# EAGLE design rasp_rak833 (EAGLE 8.3.2)
PROJECT_AUTHOR: Daniel Knox; PROJECT_LICENSE: CC-SA-BY 4.0; PROJECT_NAME: RAK833 HAT; PROJECT_VERSION: 1
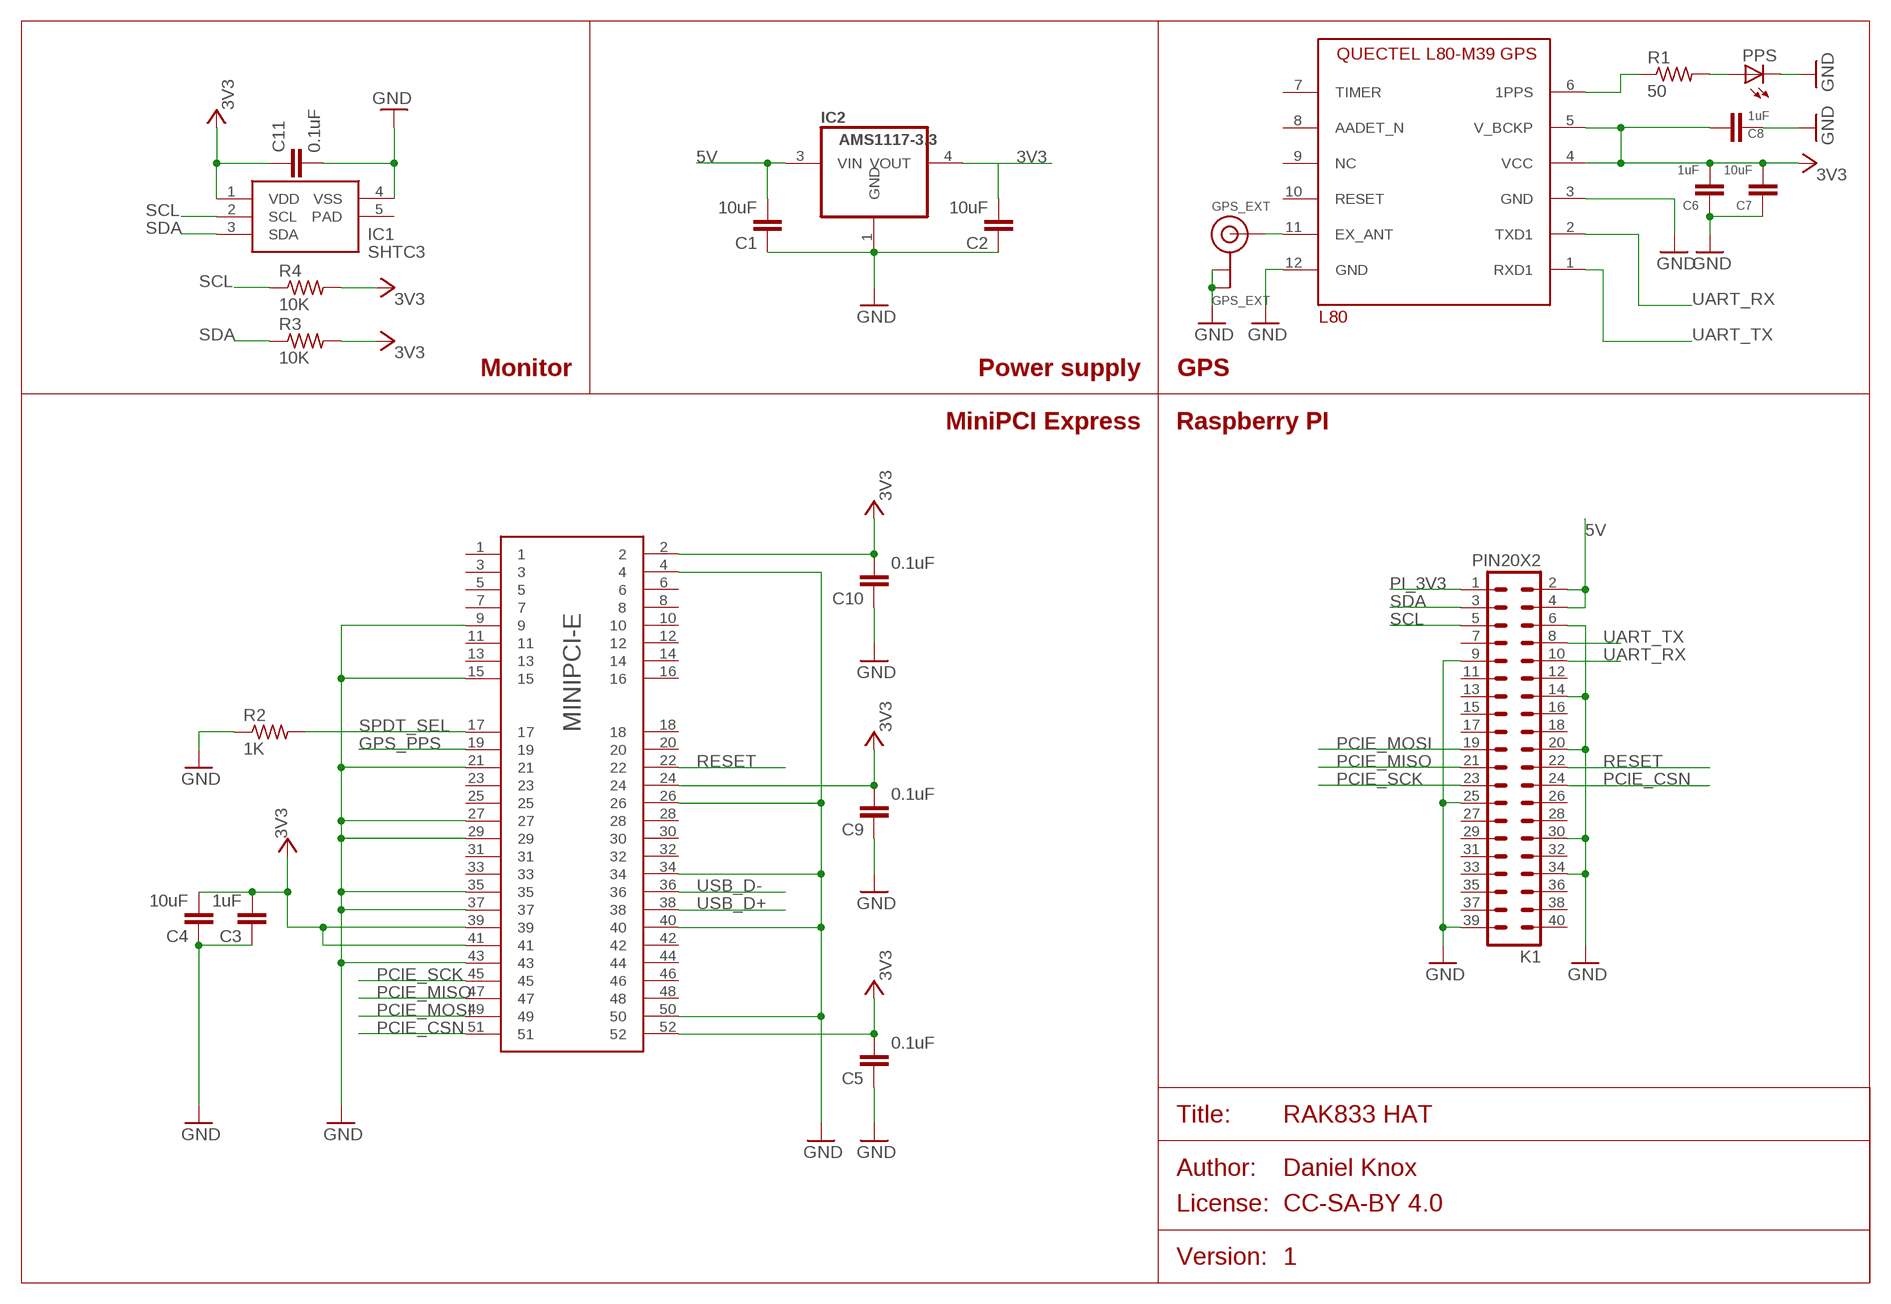
[diagram p0: schematic, sheet 1]

## Parts
C1  10uF  C-EU0805  [0805]
C2  10uF  C-EU0805  [0805]
C3  1uF  C-EU0805  [0805]
C4  10uF  C-EU0805  [0805]
C5  0.1uF  C-EU0805  [0805]
C6  1uF  C-EU0805  [0805]
C7  10uF  C-EU0805  [0805]
C8  1uF  C-EU0805  [0805]
C9  0.1uF  C-EU0805  [0805]
C10  0.1uF  C-EU0805  [0805]
C11  0.1uF  C-EU0805  [0805]
GPS_EXT  GPS_EXT  ANTENNA_U.FL  [U.FL]
IC1  SHTC3  [SHTC3]
IC2  AMS1117-3.3  REG1117SOT223-2  [SOT223]
K1  PIN20X2  [PIN_20X2]
L80  L80_GNSS_MODULE  [L80_PACKAGE]
MINIPCI-E  MINI-PCIE-RAW  [67910-MINI-PCIE]
PPS  LEDCHIP-LED0805  [CHIP-LED0805]
R1  50  R-US_R0805  [R0805]
R2  1K  R-US_R0805  [R0805]
R3  10K  R-US_R0805  [R0805]
R4  10K  R-US_R0805  [R0805]

## Nets
3V3: C2.2 C3.2 C4.2 C5.2 C6.2 C7.2 C8.2 C9.2 C10.2 IC2.4(VOUT) L80.4(VCC) L80.5(V_BCKP) MINIPCI-E.2 MINIPCI-E.24 MINIPCI-E.39 MINIPCI-E.41 MINIPCI-E.52
5V: C1.2 IC2.3(VIN) K1.2 K1.4
GND: C1.1 C2.1 C3.1 C4.1 C5.1 C6.1 C7.1 C8.1 C9.1 C10.1 C11.2 GPS_EXT.1(GND) GPS_EXT.2(GND) IC1.4(VSS) IC2.1(GND) K1.6 K1.9 K1.14 K1.20 K1.25 K1.30 K1.34 K1.39 L80.3(GND) L80.12(GND) MINIPCI-E.4 MINIPCI-E.9 MINIPCI-E.15 MINIPCI-E.21 MINIPCI-E.26 MINIPCI-E.27 MINIPCI-E.29 MINIPCI-E.34 MINIPCI-E.35 MINIPCI-E.37 MINIPCI-E.40 MINIPCI-E.43 MINIPCI-E.50 PPS.C R2.1
GPS_PPS: L80.6(1PPS) MINIPCI-E.19 R1.1
N$1: GPS_EXT.3(SIGNAL) L80.11(EX_ANT)
N$2: PPS.A R1.2
PCIE_CSN: K1.24 MINIPCI-E.51
PCIE_MISO: K1.21 MINIPCI-E.47
PCIE_MOSI: K1.19 MINIPCI-E.49
PCIE_SCK: K1.23 MINIPCI-E.45
PI_3V3: C11.1 IC1.1(VDD) K1.1 R3.2 R4.2 ; supply symbol labelled 3V3
RESET: K1.22 MINIPCI-E.22
SCL: IC1.2(SCL) K1.5 R4.1
SDA: IC1.3(SDA) K1.3 R3.1
SPDT_SEL: MINIPCI-E.17 R2.2
UART_RX: K1.10 L80.2(TXD1)
UART_TX: K1.8 L80.1(RXD1)
USB_D+: MINIPCI-E.38
USB_D-: MINIPCI-E.36
Unconnected: IC1.5(PAD) K1.7 K1.11 K1.12 K1.13 K1.15 K1.16 K1.17 K1.18 K1.26 K1.27 K1.28 K1.29 K1.31 K1.32 K1.33 K1.35 K1.36 K1.37 K1.38 K1.40 L80.7(TIMER) L80.8(AADET_N) L80.9(NC) L80.10(RESET) MINIPCI-E.1 MINIPCI-E.3 MINIPCI-E.5 MINIPCI-E.6 MINIPCI-E.7 MINIPCI-E.8 MINIPCI-E.10 MINIPCI-E.11 MINIPCI-E.12 MINIPCI-E.13 MINIPCI-E.14 MINIPCI-E.16 MINIPCI-E.18 MINIPCI-E.20 MINIPCI-E.23 MINIPCI-E.25 MINIPCI-E.28 MINIPCI-E.30 MINIPCI-E.31 MINIPCI-E.32 MINIPCI-E.33 MINIPCI-E.42 MINIPCI-E.44 MINIPCI-E.46 MINIPCI-E.48

## Notes on the sheet
- Monitor | Power supply | GPS
- MiniPCI Express | Raspberry PI

## Library data of the parts
C1-C11 = xose:C-EU: CAPACITOR, European symbol
GPS_EXT = adafruit:ANTENNA_U.FL: U.FL Antenna Connector
IC1 = SHTC3:SHTC3: Humidity and Temperature Sensor IC Source: Datasheet <https://www.glynshop.com/erp/owweb/Daten/Datenblaetter/Sensirion/SHTC3.pdf>; ARROW_PART_NUMBER: SHTC3; ARROW_PRICE/STOCK: http://www.arrow.com/en/products/shtc3/sensirion; DESCRIPTION: Humidity and Temperature Sensor IC; HEIGHT: 0mm; MANUFACTURER_NAME: Sensirion; MANUFACTURER_PART_NUMBER: SHTC3
IC2 = xose:REG1117: 800mA and 1A Low Dropout (LDO) Positive Regulator 1.8V, 2.5V, 2.85V, 3.3V, 5V, and Adj
K1 = FLYFISH:PIN20X2
L80 = Quectel:L80_GNSS_MODULE: GPS module with an embedded patch antenna (15mmx15mmx4mm)
MINIPCI-E = jt-con-molex:MINI-PCIE: Mini PCI-E card
PPS = adafruit:LED: LED OSRAM: - CHIPLED LG R971, LG N971, LY N971, LG Q971, LY Q971, LO R971, LY R971 LH N974, LH R974 LS Q976, LO Q976, LY Q976 LO Q996 - Hyper CHIPLED LW Q18S LB Q993, LB Q99A, LB R99A - SideLED LS A670, LO A670, LY A670, LG A670, LP A670 LB A673, LV A673, LT A673, LW A673 LH A674 LY A675 LS A676, LA A676, LO A676, LY A676, LW A676 LS A679, LY A679, LG A679 - Hyper Micro SIDELED® LS Y876, LA Y876, LO Y876, LY Y876 LT Y87S - SmartLED LW L88C, LW L88S LB L89C, LB L89S, LG L890 LS L89K, LO L89K, LY L89K LS L896, LA L896, LO L896, LY L896 - TOPLED LS T670, LO T670, LY T670, LG T670, LP T670 LSG T670, LSP T670, LSY T670, LOP T670, LYG T670 LG T671, LOG T671, LSG T671 LB T673, LV T673, LT T673, LW T673 LH T674 LS T676, LA T676, LO T676, LY T676, LB T676, LH T676, LSB T676, LW T676 LB T67C, LV T67C, LT T67C, LS T67K, LO T67K, LY T67K, LW E67C LS E67B, LA E67B, LO E67B, LY E67B, LB E67C, LV E67C, LT E67C LW T67C LS T679, LY T679, LG T679 LS T770, LO T770, LY T770, LG T770, LP T770 LB T773, LV T773, LT T773, LW T773 LH T774 LS E675, LA E675, LY E675, LS T675 LS T776, LA T776, LO T776, LY T776, LB T776 LHGB T686 LT T68C, LB T68C - Hyper Mini TOPLED® LB M676 - Mini TOPLED Santana® LG M470 LS M47K, LO M47K, LY M47K Source: http://www.osram.convergy.de/
R1-R4 = adafruit:R-US_: RESISTOR, American symbol

## Board
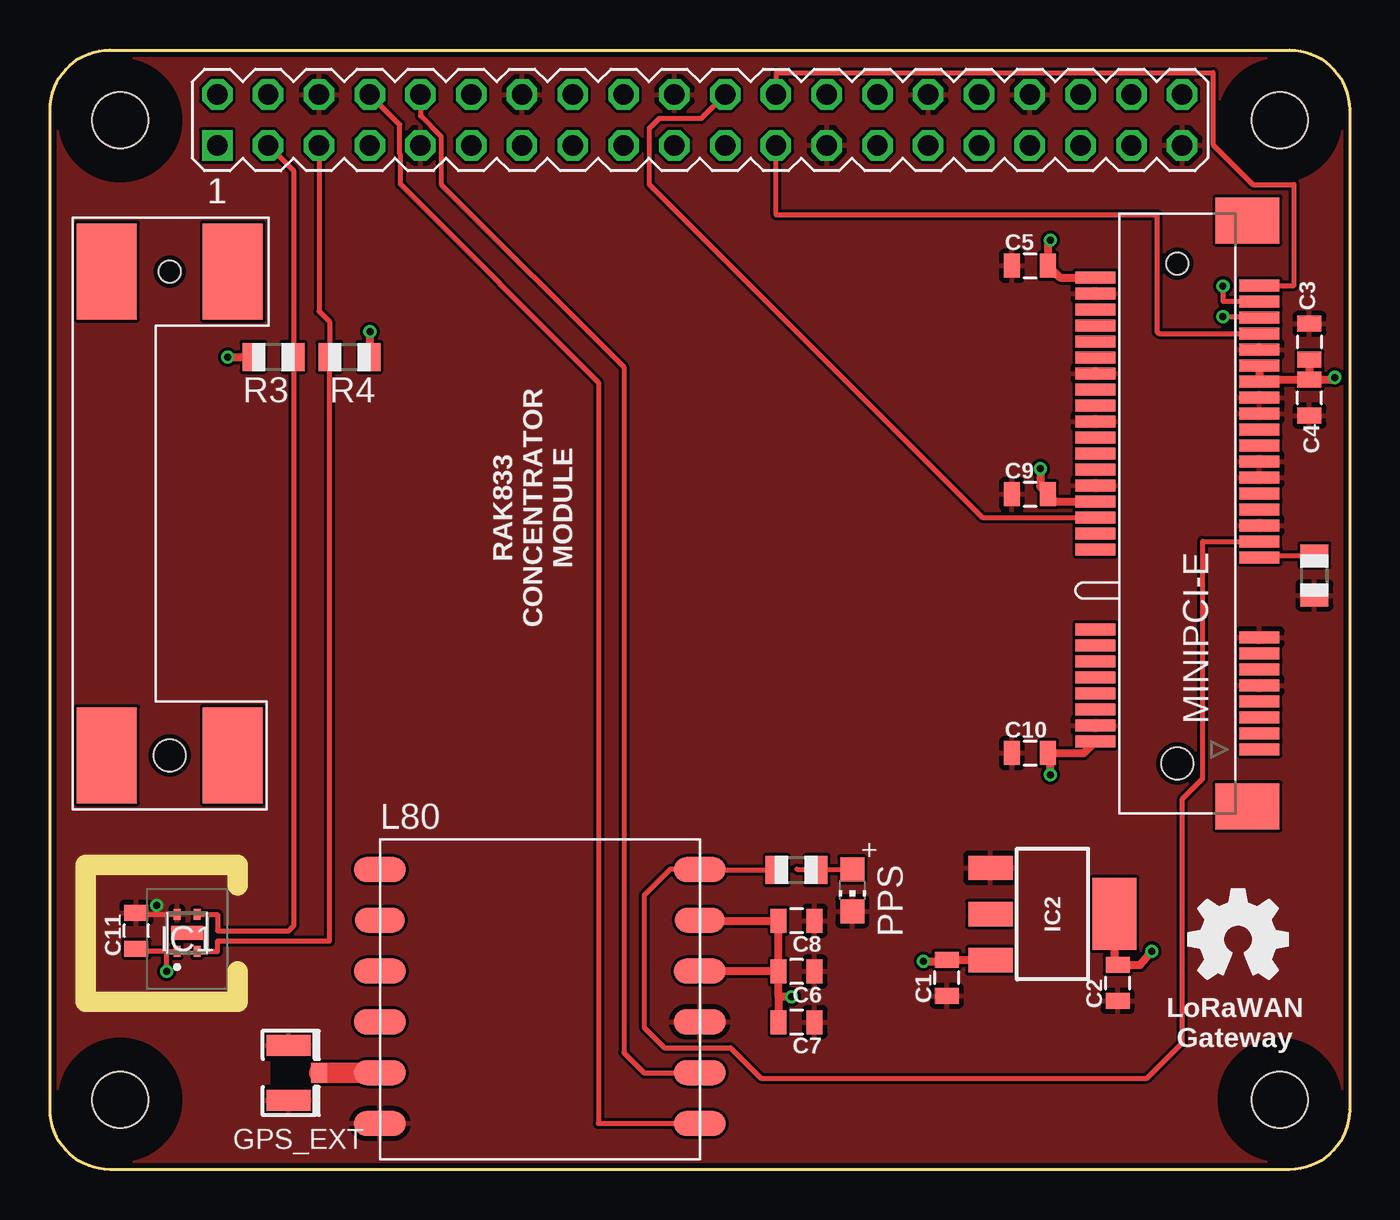
[diagram p1: board, top side]
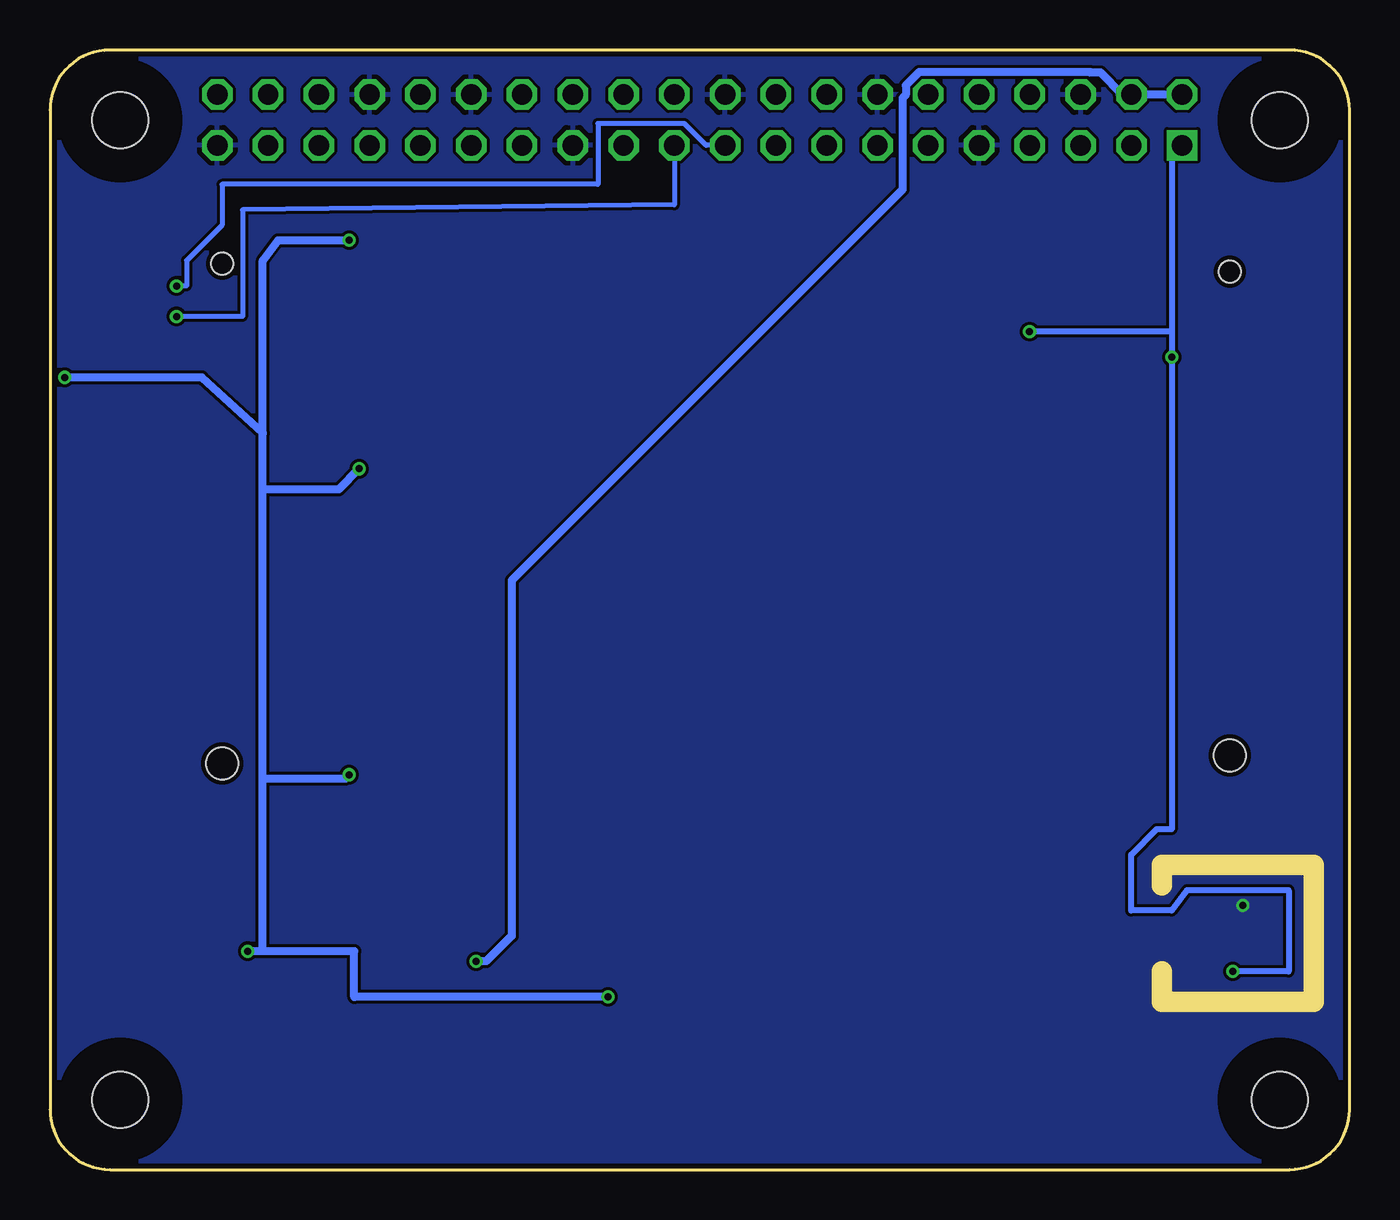
[diagram p2: board, bottom side, seen from below]

Size 65 x 56 mm. Coordinates in mm from the lower left corner, seen from the top.
Outline: 0,3 0,53 arc-90 3,56 62,56 arc-90 65,53 65,3 arc-90 62,0 3,0 arc-90 0,3
Copper layers (1*16): Top 0.035mm / dielectric 1.5mm / Bottom 0.035mm
Design rules "SeeedStudio_2layer_DRU_no_angle_20140221": minimum track width 6mil, minimum drill 12mil, track to track 6mil, track to pad 6mil, pad to pad 6mil, via to via 6mil, smd to smd 0mil, copper to edge 10mil, drill to drill 10mil, minimum pad ring 10mil, minimum via ring 6mil, stop-mask expansion 2mil, vias tented up to drill 100mil, thermal gap 10mil
Holes 2.8 mm at 3.5,3.5 3.5,52.5 61.5,52.5 61.5,3.5
tRestrict: area 1.9,51 to 5,54; area 60,51 to 63,54; area 60,1.9 to 63,5; area 1.9,1.9 to 5,5
bRestrict: area 1.9,1.9 to 5,5; area 1.9,51 to 5,54; area 60,1.9 to 63,5; area 60,51 to 63,54
Milling: 5 lines

### Footprints (pad centres in the part's own frame; a part is rotated, then mirrored left to right if it is on the bottom)
0805 = smd 0.8 x 1.2: 1 -0.9,0; 2 0.9,0
U.FL = smd 2.2 x 1.05: 1 0,1.375; 2 0,-1.375 | smd 0.8 x 1: 3 1.525,0
SHTC3 = smd 0.35 x 0.55: 1 -0.5,-0.525; 2 0.5,-0.525; 3 0.5,1.325; 4 -0.5,1.325 | smd 1.6 x 0.7: 5 0,0.4
SOT223 = smd 1.219 x 2.235: 1 -2.311,-3.099; 2 0,-3.099; 3 2.311,-3.099 | smd 3.6 x 2.2: 4 0,3.099
PIN_20X2 = drill 1.016 square: 1 -24.13,-1.27 | drill 1.016 octagon: 2 -24.13,1.27; 3 -21.59,-1.27; 4 -21.59,1.27; 5 -19.05,-1.27; 6 -19.05,1.27; 7 -16.51,-1.27; 8 -16.51,1.27; 9 -13.97,-1.27; 10 -13.97,1.27; 11 -11.43,-1.27; 12 -11.43,1.27; 13 -8.89,-1.27; 14 -8.89,1.27; 15 -6.35,-1.27; 16 -6.35,1.27; 17 -3.81,-1.27; 18 -3.81,1.27; 19 -1.27,-1.27; 20 -1.27,1.27; 21 1.27,-1.27; 22 1.27,1.27; 23 3.81,-1.27; 24 3.81,1.27; 25 6.35,-1.27; 26 6.35,1.27; 27 8.89,-1.27; 28 8.89,1.27; 29 11.43,-1.27; 30 11.43,1.27; 31 13.97,-1.27; 32 13.97,1.27; 33 16.51,-1.27; 34 16.51,1.27; 35 19.05,-1.27; 36 19.05,1.27; 37 21.59,-1.27; 38 21.59,1.27; 39 24.13,-1.27; 40 24.13,1.27
L80_PACKAGE = smd 2.6 x 1.25: 1 16,1.8; 2 16,4.34; 3 16,6.88; 4 16,9.42; 6 16,14.5; 7 0,14.5; 9 0,9.42; 10 0,6.88; 11 0,4.34; 12 0,1.8 | smd 2.5 x 1.25: 5 16,11.96; 8 0,11.96
67910-MINI-PCIE = smd 0.6 x 2: 1 0,0; 2 0.4,8.2; 3 0.8,0; 4 1.2,8.2; 5 1.6,0; 6 2,8.2; 7 2.4,0; 8 2.8,8.2; 9 3.2,0; 10 3.6,8.2; 11 4,0; 12 4.4,8.2; 13 4.8,0; 14 5.2,8.2; 15 5.6,0; 16 6,8.2; 17 9.6,0; 18 10,8.2; 19 10.4,0; 20 10.8,8.2; 21 11.2,0; 22 11.6,8.2; 23 12,0; 24 12.4,8.2; 25 12.8,0; 26 13.2,8.2; 27 13.6,0; 28 14,8.2; 29 14.4,0; 30 14.8,8.2; 31 15.2,0; 32 15.6,8.2; 33 16,0; 34 16.4,8.2; 35 16.8,0; 36 17.2,8.2; 37 17.6,0; 38 18,8.2; 39 18.4,0; 40 18.8,8.2; 41 19.2,0; 42 19.6,8.2; 43 20,0; 44 20.4,8.2; 45 20.8,0; 46 21.2,8.2; 47 21.6,0; 48 22,8.2; 49 22.4,0; 50 22.8,8.2; 51 23.2,0; 52 23.6,8.2 | smd 2.3 x 3.2: C1 -2.85,0.6; C2 26.45,0.6 | smd 4.8 x 3: D1 -0.3,57.65; D2 -0.3,51.35; D3 23.9,51.35; D4 23.9,57.65 | hole 1.6: -0.7,4.1; -0.3,54.5 | hole 1.1: 24.3,4.1; 23.9,54.5
CHIP-LED0805 = smd 1.2 x 1.2: A 0,-1.05; C 0,1.05
R0805 = smd 1.1 x 1.4: 1 -1,0; 2 1,0

### Placement (x,y rotation side)
C1  44.86,9.59 90 top
C2  53.4,9.33 90 top
C3  62.99,41.4 270 top
C4  62.99,38.61 90 top
C5  49.02,45.21 0 top
C6  37.34,9.91 180 top
C7  37.34,7.37 180 top
C8  37.34,12.45 180 top
C9  49.02,33.78 0 top
C10  49.02,20.83 0 top
C11  4.32,11.94 90 top
GPS_EXT  11.94,4.83 0 top
IC1  6.86,11.43 0 top
IC2  50.15,12.78 270 top
K1  32.5,52.5 0 top
L80  16.51,0.51 0 top
MINIPCI-E  60.49,21.02 90 top
PPS  40.13,13.97 180 top
R1  37.34,14.99 0 top
R2  63.25,29.72 90 top
R3  11.18,40.64 180 top
R4  14.99,40.64 0 top

### Tracks (layer width: path | path; a pad name or v marks a point on that pad's centre or on a via)
3V3  (via drill 0.35)
  Top 0.254: 32.53,12.45 L80.5 | 32.53,9.95 L80.4
  Top 0.406: IC2.4 53.24,10.39 C2.2 54.54,10.23 v55.12,10.92 | 50.04,19.87 v50.04,19.75 50.04,20.71 C10.2 51.7,20.83 MINIPCI-E.2 | v49.53,35.05 49.53,34.17 C9.2 50.29,33.42 MINIPCI-E.24 | v50.04,46.48 49.92,46.37 C5.2 50.52,44.62 MINIPCI-E.52 | v64.26,39.62 64.15,39.51 C4.2 | C3.2 C4.2 | MINIPCI-E.41 MINIPCI-E.39 60.58,39.51 C4.2 | L80.5 32.51,12.45 C8.2 C6.2 | 36.44,8.64 C6.2 | 36.44,8.64 C7.2 | v37.08,8.64 36.44,8.64 | C6.2 36.44,9.93 L80.4
  Bottom 0.254: 54.36,10.92 50.8,10.92
  Bottom 0.406: 54.36,10.92 v55.12,10.92 | 54.36,10.92 54.36,19.56 | 54.36,19.56 50.23,19.56 v50.04,19.75 | 54.36,19.56 54.36,34.04 | 54.36,34.04 50.55,34.04 v49.53,35.05 | 54.36,34.04 54.36,36.83 | 54.36,36.83 54.36,45.47 53.59,46.48 v50.04,46.48 | 54.36,36.83 57.4,39.62 v64.26,39.62 | 54.36,10.92 49.78,10.92 49.78,8.64 v37.08,8.64
5V  (via drill 0.35)
  Top 0.406: v43.69,10.41 44.79,10.41 C1.2 44.88,10.47 IC2.3
  Bottom 0.406: 11.51,53.77 K1.2 K1.4 11.35,53.77 12.45,54.86 12.96,54.86 12.99,54.89 21.53,54.89 22.19,54.23 22.19,53.76 22.35,53.59 22.35,49.02 41.91,29.46 41.91,11.68 43.18,10.41 v43.69,10.41
GND  (via drill 0.35)
  Top 0.254: C11.2 4.4,12.76 5.08,12.76 5.33,12.76 | 5.33,12.76 IC1.4 | 5.33,12.76 v5.33,13.21
  pour Top: -1,57 66,57 66,-1 -1,-1
  pour Bottom: 0.25,-0.51 65.53,-0.51 65.53,6.1 65.53,56.39 -0.25,56.39 -0.25,-0.51
GPS_PPS
  Top 0.254: R1.1 32.53,14.99 L80.6 31.01,15.01 29.72,13.72 29.72,7.11 30.73,6.1 34.04,6.1 35.56,4.57 54.86,4.57 56.64,6.35 56.64,18.54 57.66,19.56 57.66,31.42 MINIPCI-E.19
N$1
  Top 1.016: L80.11 13.48,4.85 GPS_EXT.3
N$2
  Top 0.254: R1.2 37.36,15.02 PPS.A
PCIE_CSN
  Top 0.254: K1.24 36.32,53.77 36.32,54.86 58.17,54.86 58.17,51.27 60.16,49.27 62.23,49.27 62.23,44.22 MINIPCI-E.51
PCIE_MISO  (via drill 0.35)
  Top 0.254: 60.44,42.67 MINIPCI-E.47 60.49,42.67 v58.67,42.67
  Bottom 0.254: K1.21 33.77,48.26 55.37,48.01 55.37,42.67 v58.67,42.67
PCIE_MOSI  (via drill 0.35)
  Top 0.254: 60.49,43.43 MINIPCI-E.49 60.46,43.45 60.45,43.43 58.67,43.43 v58.67,44.2
  Bottom 0.254: K1.19 32.18,51.23 33.27,52.32 37.59,52.32 37.59,49.28 56.39,49.28 56.39,47.24 58.17,45.47 58.17,44.2 v58.67,44.2
PCIE_SCK
  Top 0.254: K1.23 36.32,51.23 36.32,47.75 55.37,47.75 55.37,41.91 55.47,41.82 MINIPCI-E.45
PI_3V3  (via drill 0.35)
  Top 0.254: C11.1 4.45,10.9 5.84,10.9 | 5.84,10.9 IC1.1 | v5.84,9.91 5.84,10.9
  Top 0.406: v8.89,40.64 R3.2 | v16,41.91 15.99,41.89 R4.2
  Bottom 0.305: 8.89,50.71 8.89,41.91 | 8.89,41.91 v8.89,40.64 8.89,17.02 9.65,17.02 10.92,15.75 10.92,12.95 8.89,12.95 8.13,13.97 3.05,13.97 3.05,9.91 v5.84,9.91 | 8.89,41.91 v16,41.91
  Bottom 0.406: K1.1 8.89,50.71
RESET
  Top 0.254: K1.22 32.58,52.58 30.48,52.58 29.97,52.07 29.97,49.28 46.63,32.62 MINIPCI-E.22
SCL
  Top 0.254: K1.5 13.46,51.22 13.46,42.93 13.99,42.4 R4.1 13.97,40.37 13.97,11.43 8.38,11.43 8.38,10.9 IC1.2
SDA
  Top 0.254: K1.3 12.18,49.96 R3.1 12.19,40.62 12.19,12.19 11.94,11.94 8.38,11.94 8.38,12.76 IC1.3 7.41,12.7
SPDT_SEL
  Top 0.254: MINIPCI-E.17 60.59,30.72 R2.2
UART_RX
  Top 0.254: K1.10 18.53,52.7 19.57,51.66 19.57,49.26 28.7,40.13 28.7,5.84 29.72,4.83 32.49,4.83 L80.2
UART_TX
  Top 0.254: K1.8 17.49,52.27 17.49,50.8 17.53,50.76 17.53,49.28 27.43,39.37 27.43,2.31 L80.1

### Text on the board
tNames: RAK833 / CONCENTRATOR / MODULE | LoRaWAN / Gateway